# Altium project Service_board.PrjPcb (part 4 of 9)
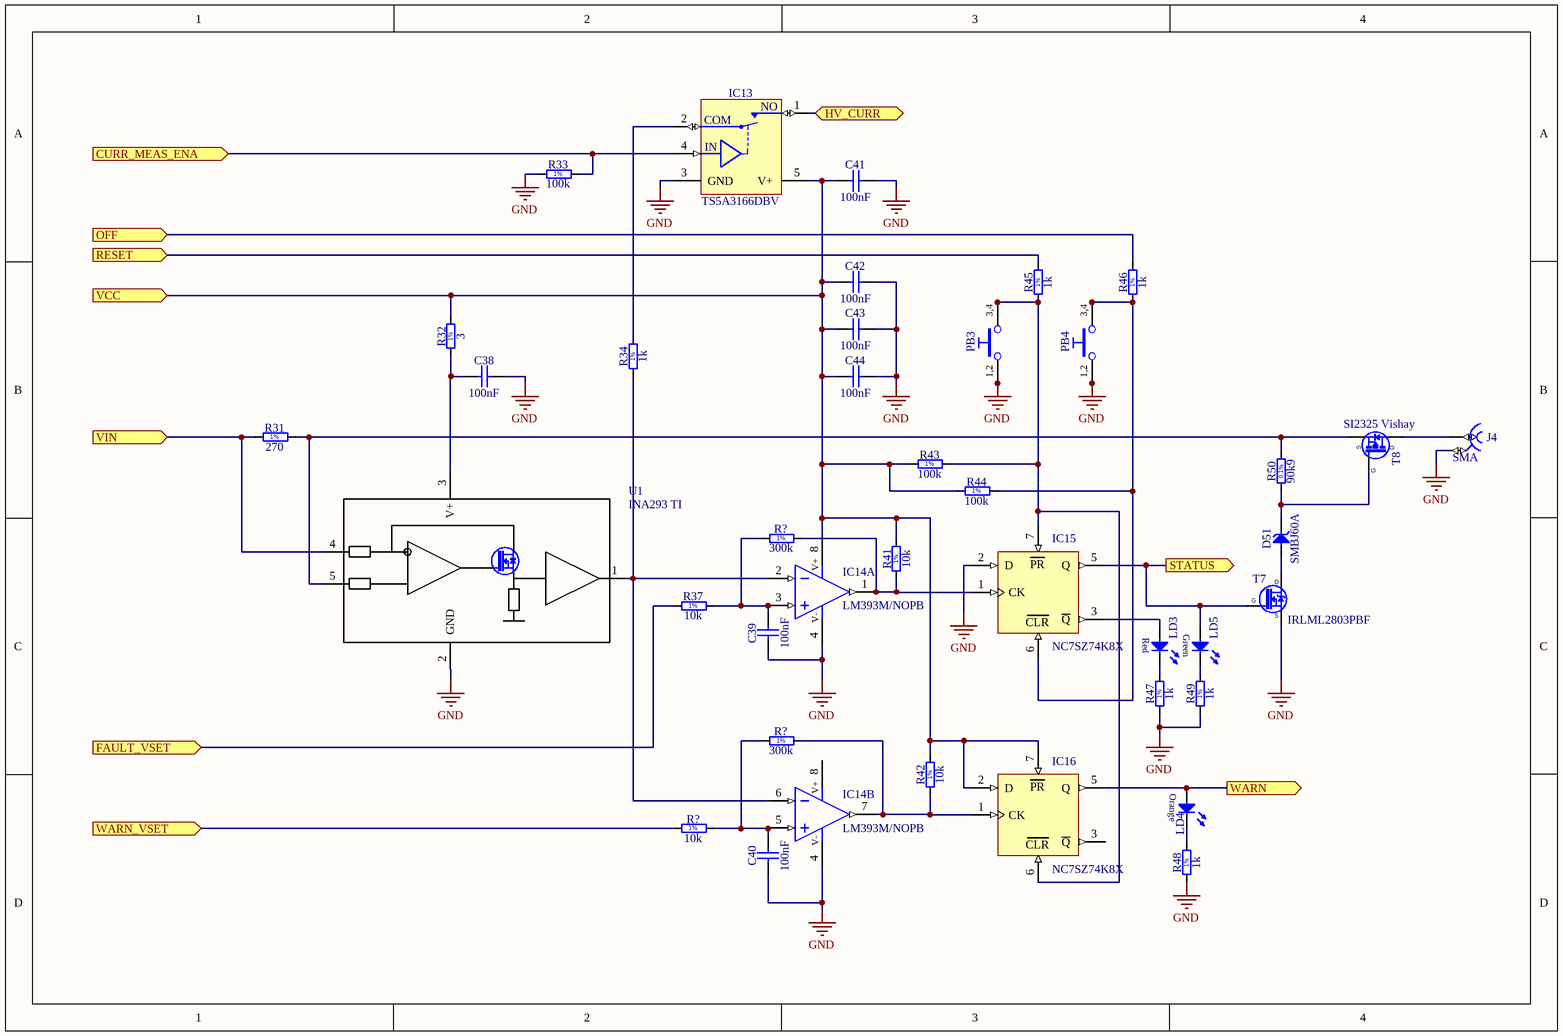
[diagram p10: Switch.SchDoc]

## Sheet Switch.SchDoc (continued)
### Channels
U_Bank/U_Channel/U_Switch: designators C38=C38_U_Bank_U_Channel_U_Switch#1 C39=C39_U_Bank_U_Channel_U_Switch#1 C40=C40_U_Bank_U_Channel_U_Switch#1 C41=C41_U_Bank_U_Channel_U_Switch#1 C42=C42_U_Bank_U_Channel_U_Switch#1 C43=C43_U_Bank_U_Channel_U_Switch#1 C44=C44_U_Bank_U_Channel_U_Switch#1 D51=D51_U_Bank_U_Channel_U_Switch#1 IC13=IC13_U_Bank_U_Channel_U_Switch#1 IC14=IC14_U_Bank_U_Channel_U_Switch#1 IC15=IC15_U_Bank_U_Channel_U_Switch#1 IC16=IC16_U_Bank_U_Channel_U_Switch#1 J4=J4_U_Bank_U_Channel_U_Switch#1 LD3=LD3_U_Bank_U_Channel_U_Switch#1 LD4=LD4_U_Bank_U_Channel_U_Switch#1 LD5=LD5_U_Bank_U_Channel_U_Switch#1 PB3=PB3_U_Bank_U_Channel_U_Switch#1 PB4=PB4_U_Bank_U_Channel_U_Switch#1 R31=R31_U_Bank_U_Channel_U_Switch#1 R32=R32_U_Bank_U_Channel_U_Switch#1 R33=R33_U_Bank_U_Channel_U_Switch#1 R34=R34_U_Bank_U_Channel_U_Switch#1 R37=R37_U_Bank_U_Channel_U_Switch#1 R41=R41_U_Bank_U_Channel_U_Switch#1 R42=R42_U_Bank_U_Channel_U_Switch#1 R43=R43_U_Bank_U_Channel_U_Switch#1 R44=R44_U_Bank_U_Channel_U_Switch#1 R45=R45_U_Bank_U_Channel_U_Switch#1 R46=R46_U_Bank_U_Channel_U_Switch#1 R47=R47_U_Bank_U_Channel_U_Switch#1 R48=R48_U_Bank_U_Channel_U_Switch#1 R49=R49_U_Bank_U_Channel_U_Switch#1 R50=R50_U_Bank_U_Channel_U_Switch#1 R?=R?_U_Bank_U_Channel_U_Switch#3 R?=R?_U_Bank_U_Channel_U_Switch#2 R?=R?_U_Bank_U_Channel_U_Switch#1 T7=T7_U_Bank_U_Channel_U_Switch#1 T8=T8_U_Bank_U_Channel_U_Switch#1 U1=U1_U_Bank_U_Channel_U_Switch#1; ports CURR_MEAS_ENA=NetIC2_U_Bank_U_Channel#1_14 FAULT_VSET=NetR37_U_Bank_U_Channel_U_Switch#1_1 HV_CURR=NetIC8_23 OFF=NetIC2_U_Bank_U_Channel#1_18 RESET=NetIC2_U_Bank_U_Channel#1_16 STATUS=NetIC2_U_Bank_U_Channel#1_8 VCC=NetC41_U_Bank_U_Channel_U_Switch#1_1 VIN=NetC?#3_2 WARN=W_A0 WARN_VSET=NetR?_U_Bank_U_Channel_U_Switch#3_1
U_Bank/U_Channel/U_Switch: designators C38=C38_U_Bank_U_Channel_U_Switch#2 C39=C39_U_Bank_U_Channel_U_Switch#2 C40=C40_U_Bank_U_Channel_U_Switch#2 C41=C41_U_Bank_U_Channel_U_Switch#2 C42=C42_U_Bank_U_Channel_U_Switch#2 C43=C43_U_Bank_U_Channel_U_Switch#2 C44=C44_U_Bank_U_Channel_U_Switch#2 D51=D51_U_Bank_U_Channel_U_Switch#2 IC13=IC13_U_Bank_U_Channel_U_Switch#2 IC14=IC14_U_Bank_U_Channel_U_Switch#2 IC15=IC15_U_Bank_U_Channel_U_Switch#2 IC16=IC16_U_Bank_U_Channel_U_Switch#2 J4=J4_U_Bank_U_Channel_U_Switch#2 LD3=LD3_U_Bank_U_Channel_U_Switch#2 LD4=LD4_U_Bank_U_Channel_U_Switch#2 LD5=LD5_U_Bank_U_Channel_U_Switch#2 PB3=PB3_U_Bank_U_Channel_U_Switch#2 PB4=PB4_U_Bank_U_Channel_U_Switch#2 R31=R31_U_Bank_U_Channel_U_Switch#2 R32=R32_U_Bank_U_Channel_U_Switch#2 R33=R33_U_Bank_U_Channel_U_Switch#2 R34=R34_U_Bank_U_Channel_U_Switch#2 R37=R37_U_Bank_U_Channel_U_Switch#2 R41=R41_U_Bank_U_Channel_U_Switch#2 R42=R42_U_Bank_U_Channel_U_Switch#2 R43=R43_U_Bank_U_Channel_U_Switch#2 R44=R44_U_Bank_U_Channel_U_Switch#2 R45=R45_U_Bank_U_Channel_U_Switch#2 R46=R46_U_Bank_U_Channel_U_Switch#2 R47=R47_U_Bank_U_Channel_U_Switch#2 R48=R48_U_Bank_U_Channel_U_Switch#2 R49=R49_U_Bank_U_Channel_U_Switch#2 R50=R50_U_Bank_U_Channel_U_Switch#2 R?=R?_U_Bank_U_Channel_U_Switch#6 R?=R?_U_Bank_U_Channel_U_Switch#5 R?=R?_U_Bank_U_Channel_U_Switch#4 T7=T7_U_Bank_U_Channel_U_Switch#2 T8=T8_U_Bank_U_Channel_U_Switch#2 U1=U1_U_Bank_U_Channel_U_Switch#2; ports CURR_MEAS_ENA=NetIC2_U_Bank_U_Channel#1_7 FAULT_VSET=NetR37_U_Bank_U_Channel_U_Switch#1_1 HV_CURR=NetIC8_23 OFF=NetIC2_U_Bank_U_Channel#1_3 RESET=NetIC2_U_Bank_U_Channel#1_5 STATUS=NetIC2_U_Bank_U_Channel#1_11 VCC=NetC41_U_Bank_U_Channel_U_Switch#1_1 VIN=NetC?#3_2 WARN=W_B0 WARN_VSET=NetR?_U_Bank_U_Channel_U_Switch#3_1
U_Bank/U_Channel/U_Switch: designators C38=C38_U_Bank_U_Channel_U_Switch#3 C39=C39_U_Bank_U_Channel_U_Switch#3 C40=C40_U_Bank_U_Channel_U_Switch#3 C41=C41_U_Bank_U_Channel_U_Switch#3 C42=C42_U_Bank_U_Channel_U_Switch#3 C43=C43_U_Bank_U_Channel_U_Switch#3 C44=C44_U_Bank_U_Channel_U_Switch#3 D51=D51_U_Bank_U_Channel_U_Switch#3 IC13=IC13_U_Bank_U_Channel_U_Switch#3 IC14=IC14_U_Bank_U_Channel_U_Switch#3 IC15=IC15_U_Bank_U_Channel_U_Switch#3 IC16=IC16_U_Bank_U_Channel_U_Switch#3 J4=J4_U_Bank_U_Channel_U_Switch#3 LD3=LD3_U_Bank_U_Channel_U_Switch#3 LD4=LD4_U_Bank_U_Channel_U_Switch#3 LD5=LD5_U_Bank_U_Channel_U_Switch#3 PB3=PB3_U_Bank_U_Channel_U_Switch#3 PB4=PB4_U_Bank_U_Channel_U_Switch#3 R31=R31_U_Bank_U_Channel_U_Switch#3 R32=R32_U_Bank_U_Channel_U_Switch#3 R33=R33_U_Bank_U_Channel_U_Switch#3 R34=R34_U_Bank_U_Channel_U_Switch#3 R37=R37_U_Bank_U_Channel_U_Switch#3 R41=R41_U_Bank_U_Channel_U_Switch#3 R42=R42_U_Bank_U_Channel_U_Switch#3 R43=R43_U_Bank_U_Channel_U_Switch#3 R44=R44_U_Bank_U_Channel_U_Switch#3 R45=R45_U_Bank_U_Channel_U_Switch#3 R46=R46_U_Bank_U_Channel_U_Switch#3 R47=R47_U_Bank_U_Channel_U_Switch#3 R48=R48_U_Bank_U_Channel_U_Switch#3 R49=R49_U_Bank_U_Channel_U_Switch#3 R50=R50_U_Bank_U_Channel_U_Switch#3 R?=R?_U_Bank_U_Channel_U_Switch#9 R?=R?_U_Bank_U_Channel_U_Switch#8 R?=R?_U_Bank_U_Channel_U_Switch#7 T7=T7_U_Bank_U_Channel_U_Switch#3 T8=T8_U_Bank_U_Channel_U_Switch#3 U1=U1_U_Bank_U_Channel_U_Switch#3; ports CURR_MEAS_ENA=NetIC2_U_Bank_U_Channel#2_14 FAULT_VSET=NetR37_U_Bank_U_Channel_U_Switch#1_1 HV_CURR=NetIC8_23 OFF=NetIC2_U_Bank_U_Channel#2_18 RESET=NetIC2_U_Bank_U_Channel#2_16 STATUS=NetIC2_U_Bank_U_Channel#2_8 VCC=NetC41_U_Bank_U_Channel_U_Switch#1_1 VIN=NetC?#3_2 WARN=W_A1 WARN_VSET=NetR?_U_Bank_U_Channel_U_Switch#3_1
U_Bank/U_Channel/U_Switch: designators C38=C38_U_Bank_U_Channel_U_Switch#4 C39=C39_U_Bank_U_Channel_U_Switch#4 C40=C40_U_Bank_U_Channel_U_Switch#4 C41=C41_U_Bank_U_Channel_U_Switch#4 C42=C42_U_Bank_U_Channel_U_Switch#4 C43=C43_U_Bank_U_Channel_U_Switch#4 C44=C44_U_Bank_U_Channel_U_Switch#4 D51=D51_U_Bank_U_Channel_U_Switch#4 IC13=IC13_U_Bank_U_Channel_U_Switch#4 IC14=IC14_U_Bank_U_Channel_U_Switch#4 IC15=IC15_U_Bank_U_Channel_U_Switch#4 IC16=IC16_U_Bank_U_Channel_U_Switch#4 J4=J4_U_Bank_U_Channel_U_Switch#4 LD3=LD3_U_Bank_U_Channel_U_Switch#4 LD4=LD4_U_Bank_U_Channel_U_Switch#4 LD5=LD5_U_Bank_U_Channel_U_Switch#4 PB3=PB3_U_Bank_U_Channel_U_Switch#4 PB4=PB4_U_Bank_U_Channel_U_Switch#4 R31=R31_U_Bank_U_Channel_U_Switch#4 R32=R32_U_Bank_U_Channel_U_Switch#4 R33=R33_U_Bank_U_Channel_U_Switch#4 R34=R34_U_Bank_U_Channel_U_Switch#4 R37=R37_U_Bank_U_Channel_U_Switch#4 R41=R41_U_Bank_U_Channel_U_Switch#4 R42=R42_U_Bank_U_Channel_U_Switch#4 R43=R43_U_Bank_U_Channel_U_Switch#4 R44=R44_U_Bank_U_Channel_U_Switch#4 R45=R45_U_Bank_U_Channel_U_Switch#4 R46=R46_U_Bank_U_Channel_U_Switch#4 R47=R47_U_Bank_U_Channel_U_Switch#4 R48=R48_U_Bank_U_Channel_U_Switch#4 R49=R49_U_Bank_U_Channel_U_Switch#4 R50=R50_U_Bank_U_Channel_U_Switch#4 R?=R?_U_Bank_U_Channel_U_Switch#12 R?=R?_U_Bank_U_Channel_U_Switch#11 R?=R?_U_Bank_U_Channel_U_Switch#10 T7=T7_U_Bank_U_Channel_U_Switch#4 T8=T8_U_Bank_U_Channel_U_Switch#4 U1=U1_U_Bank_U_Channel_U_Switch#4; ports CURR_MEAS_ENA=NetIC2_U_Bank_U_Channel#2_7 FAULT_VSET=NetR37_U_Bank_U_Channel_U_Switch#1_1 HV_CURR=NetIC8_23 OFF=NetIC2_U_Bank_U_Channel#2_3 RESET=NetIC2_U_Bank_U_Channel#2_5 STATUS=NetIC2_U_Bank_U_Channel#2_11 VCC=NetC41_U_Bank_U_Channel_U_Switch#1_1 VIN=NetC?#3_2 WARN=W_B1 WARN_VSET=NetR?_U_Bank_U_Channel_U_Switch#3_1
U_Bank/U_Channel/U_Switch: designators C38=C38_U_Bank_U_Channel_U_Switch#5 C39=C39_U_Bank_U_Channel_U_Switch#5 C40=C40_U_Bank_U_Channel_U_Switch#5 C41=C41_U_Bank_U_Channel_U_Switch#5 C42=C42_U_Bank_U_Channel_U_Switch#5 C43=C43_U_Bank_U_Channel_U_Switch#5 C44=C44_U_Bank_U_Channel_U_Switch#5 D51=D51_U_Bank_U_Channel_U_Switch#5 IC13=IC13_U_Bank_U_Channel_U_Switch#5 IC14=IC14_U_Bank_U_Channel_U_Switch#5 IC15=IC15_U_Bank_U_Channel_U_Switch#5 IC16=IC16_U_Bank_U_Channel_U_Switch#5 J4=J4_U_Bank_U_Channel_U_Switch#5 LD3=LD3_U_Bank_U_Channel_U_Switch#5 LD4=LD4_U_Bank_U_Channel_U_Switch#5 LD5=LD5_U_Bank_U_Channel_U_Switch#5 PB3=PB3_U_Bank_U_Channel_U_Switch#5 PB4=PB4_U_Bank_U_Channel_U_Switch#5 R31=R31_U_Bank_U_Channel_U_Switch#5 R32=R32_U_Bank_U_Channel_U_Switch#5 R33=R33_U_Bank_U_Channel_U_Switch#5 R34=R34_U_Bank_U_Channel_U_Switch#5 R37=R37_U_Bank_U_Channel_U_Switch#5 R41=R41_U_Bank_U_Channel_U_Switch#5 R42=R42_U_Bank_U_Channel_U_Switch#5 R43=R43_U_Bank_U_Channel_U_Switch#5 R44=R44_U_Bank_U_Channel_U_Switch#5 R45=R45_U_Bank_U_Channel_U_Switch#5 R46=R46_U_Bank_U_Channel_U_Switch#5 R47=R47_U_Bank_U_Channel_U_Switch#5 R48=R48_U_Bank_U_Channel_U_Switch#5 R49=R49_U_Bank_U_Channel_U_Switch#5 R50=R50_U_Bank_U_Channel_U_Switch#5 R?=R?_U_Bank_U_Channel_U_Switch#15 R?=R?_U_Bank_U_Channel_U_Switch#14 R?=R?_U_Bank_U_Channel_U_Switch#13 T7=T7_U_Bank_U_Channel_U_Switch#5 T8=T8_U_Bank_U_Channel_U_Switch#5 U1=U1_U_Bank_U_Channel_U_Switch#5; ports CURR_MEAS_ENA=NetIC2_U_Bank_U_Channel#3_14 FAULT_VSET=NetR37_U_Bank_U_Channel_U_Switch#1_1 HV_CURR=NetIC8_23 OFF=NetIC2_U_Bank_U_Channel#3_18 RESET=NetIC2_U_Bank_U_Channel#3_16 STATUS=NetIC2_U_Bank_U_Channel#3_8 VCC=NetC41_U_Bank_U_Channel_U_Switch#1_1 VIN=NetC?#3_2 WARN=W_A2 WARN_VSET=NetR?_U_Bank_U_Channel_U_Switch#3_1
U_Bank/U_Channel/U_Switch: designators C38=C38_U_Bank_U_Channel_U_Switch#6 C39=C39_U_Bank_U_Channel_U_Switch#6 C40=C40_U_Bank_U_Channel_U_Switch#6 C41=C41_U_Bank_U_Channel_U_Switch#6 C42=C42_U_Bank_U_Channel_U_Switch#6 C43=C43_U_Bank_U_Channel_U_Switch#6 C44=C44_U_Bank_U_Channel_U_Switch#6 D51=D51_U_Bank_U_Channel_U_Switch#6 IC13=IC13_U_Bank_U_Channel_U_Switch#6 IC14=IC14_U_Bank_U_Channel_U_Switch#6 IC15=IC15_U_Bank_U_Channel_U_Switch#6 IC16=IC16_U_Bank_U_Channel_U_Switch#6 J4=J4_U_Bank_U_Channel_U_Switch#6 LD3=LD3_U_Bank_U_Channel_U_Switch#6 LD4=LD4_U_Bank_U_Channel_U_Switch#6 LD5=LD5_U_Bank_U_Channel_U_Switch#6 PB3=PB3_U_Bank_U_Channel_U_Switch#6 PB4=PB4_U_Bank_U_Channel_U_Switch#6 R31=R31_U_Bank_U_Channel_U_Switch#6 R32=R32_U_Bank_U_Channel_U_Switch#6 R33=R33_U_Bank_U_Channel_U_Switch#6 R34=R34_U_Bank_U_Channel_U_Switch#6 R37=R37_U_Bank_U_Channel_U_Switch#6 R41=R41_U_Bank_U_Channel_U_Switch#6 R42=R42_U_Bank_U_Channel_U_Switch#6 R43=R43_U_Bank_U_Channel_U_Switch#6 R44=R44_U_Bank_U_Channel_U_Switch#6 R45=R45_U_Bank_U_Channel_U_Switch#6 R46=R46_U_Bank_U_Channel_U_Switch#6 R47=R47_U_Bank_U_Channel_U_Switch#6 R48=R48_U_Bank_U_Channel_U_Switch#6 R49=R49_U_Bank_U_Channel_U_Switch#6 R50=R50_U_Bank_U_Channel_U_Switch#6 R?=R?_U_Bank_U_Channel_U_Switch#18 R?=R?_U_Bank_U_Channel_U_Switch#17 R?=R?_U_Bank_U_Channel_U_Switch#16 T7=T7_U_Bank_U_Channel_U_Switch#6 T8=T8_U_Bank_U_Channel_U_Switch#6 U1=U1_U_Bank_U_Channel_U_Switch#6; ports CURR_MEAS_ENA=NetIC2_U_Bank_U_Channel#3_7 FAULT_VSET=NetR37_U_Bank_U_Channel_U_Switch#1_1 HV_CURR=NetIC8_23 OFF=NetIC2_U_Bank_U_Channel#3_3 RESET=NetIC2_U_Bank_U_Channel#3_5 STATUS=NetIC2_U_Bank_U_Channel#3_11 VCC=NetC41_U_Bank_U_Channel_U_Switch#1_1 VIN=NetC?#3_2 WARN=W_B2 WARN_VSET=NetR?_U_Bank_U_Channel_U_Switch#3_1
U_Bank/U_Channel/U_Switch: designators C38=C38_U_Bank_U_Channel_U_Switch#7 C39=C39_U_Bank_U_Channel_U_Switch#7 C40=C40_U_Bank_U_Channel_U_Switch#7 C41=C41_U_Bank_U_Channel_U_Switch#7 C42=C42_U_Bank_U_Channel_U_Switch#7 C43=C43_U_Bank_U_Channel_U_Switch#7 C44=C44_U_Bank_U_Channel_U_Switch#7 D51=D51_U_Bank_U_Channel_U_Switch#7 IC13=IC13_U_Bank_U_Channel_U_Switch#7 IC14=IC14_U_Bank_U_Channel_U_Switch#7 IC15=IC15_U_Bank_U_Channel_U_Switch#7 IC16=IC16_U_Bank_U_Channel_U_Switch#7 J4=J4_U_Bank_U_Channel_U_Switch#7 LD3=LD3_U_Bank_U_Channel_U_Switch#7 LD4=LD4_U_Bank_U_Channel_U_Switch#7 LD5=LD5_U_Bank_U_Channel_U_Switch#7 PB3=PB3_U_Bank_U_Channel_U_Switch#7 PB4=PB4_U_Bank_U_Channel_U_Switch#7 R31=R31_U_Bank_U_Channel_U_Switch#7 R32=R32_U_Bank_U_Channel_U_Switch#7 R33=R33_U_Bank_U_Channel_U_Switch#7 R34=R34_U_Bank_U_Channel_U_Switch#7 R37=R37_U_Bank_U_Channel_U_Switch#7 R41=R41_U_Bank_U_Channel_U_Switch#7 R42=R42_U_Bank_U_Channel_U_Switch#7 R43=R43_U_Bank_U_Channel_U_Switch#7 R44=R44_U_Bank_U_Channel_U_Switch#7 R45=R45_U_Bank_U_Channel_U_Switch#7 R46=R46_U_Bank_U_Channel_U_Switch#7 R47=R47_U_Bank_U_Channel_U_Switch#7 R48=R48_U_Bank_U_Channel_U_Switch#7 R49=R49_U_Bank_U_Channel_U_Switch#7 R50=R50_U_Bank_U_Channel_U_Switch#7 R?=R?_U_Bank_U_Channel_U_Switch#21 R?=R?_U_Bank_U_Channel_U_Switch#20 R?=R?_U_Bank_U_Channel_U_Switch#19 T7=T7_U_Bank_U_Channel_U_Switch#7 T8=T8_U_Bank_U_Channel_U_Switch#7 U1=U1_U_Bank_U_Channel_U_Switch#7; ports CURR_MEAS_ENA=NetIC2_U_Bank_U_Channel#4_14 FAULT_VSET=NetR37_U_Bank_U_Channel_U_Switch#1_1 HV_CURR=NetIC8_23 OFF=NetIC2_U_Bank_U_Channel#4_18 RESET=NetIC2_U_Bank_U_Channel#4_16 STATUS=NetIC2_U_Bank_U_Channel#4_8 VCC=NetC41_U_Bank_U_Channel_U_Switch#1_1 VIN=NetC?#3_2 WARN=W_A3 WARN_VSET=NetR?_U_Bank_U_Channel_U_Switch#3_1
U_Bank/U_Channel/U_Switch: designators C38=C38_U_Bank_U_Channel_U_Switch#8 C39=C39_U_Bank_U_Channel_U_Switch#8 C40=C40_U_Bank_U_Channel_U_Switch#8 C41=C41_U_Bank_U_Channel_U_Switch#8 C42=C42_U_Bank_U_Channel_U_Switch#8 C43=C43_U_Bank_U_Channel_U_Switch#8 C44=C44_U_Bank_U_Channel_U_Switch#8 D51=D51_U_Bank_U_Channel_U_Switch#8 IC13=IC13_U_Bank_U_Channel_U_Switch#8 IC14=IC14_U_Bank_U_Channel_U_Switch#8 IC15=IC15_U_Bank_U_Channel_U_Switch#8 IC16=IC16_U_Bank_U_Channel_U_Switch#8 J4=J4_U_Bank_U_Channel_U_Switch#8 LD3=LD3_U_Bank_U_Channel_U_Switch#8 LD4=LD4_U_Bank_U_Channel_U_Switch#8 LD5=LD5_U_Bank_U_Channel_U_Switch#8 PB3=PB3_U_Bank_U_Channel_U_Switch#8 PB4=PB4_U_Bank_U_Channel_U_Switch#8 R31=R31_U_Bank_U_Channel_U_Switch#8 R32=R32_U_Bank_U_Channel_U_Switch#8 R33=R33_U_Bank_U_Channel_U_Switch#8 R34=R34_U_Bank_U_Channel_U_Switch#8 R37=R37_U_Bank_U_Channel_U_Switch#8 R41=R41_U_Bank_U_Channel_U_Switch#8 R42=R42_U_Bank_U_Channel_U_Switch#8 R43=R43_U_Bank_U_Channel_U_Switch#8 R44=R44_U_Bank_U_Channel_U_Switch#8 R45=R45_U_Bank_U_Channel_U_Switch#8 R46=R46_U_Bank_U_Channel_U_Switch#8 R47=R47_U_Bank_U_Channel_U_Switch#8 R48=R48_U_Bank_U_Channel_U_Switch#8 R49=R49_U_Bank_U_Channel_U_Switch#8 R50=R50_U_Bank_U_Channel_U_Switch#8 R?=R?_U_Bank_U_Channel_U_Switch#24 R?=R?_U_Bank_U_Channel_U_Switch#23 R?=R?_U_Bank_U_Channel_U_Switch#22 T7=T7_U_Bank_U_Channel_U_Switch#8 T8=T8_U_Bank_U_Channel_U_Switch#8 U1=U1_U_Bank_U_Channel_U_Switch#8; ports CURR_MEAS_ENA=NetIC2_U_Bank_U_Channel#4_7 FAULT_VSET=NetR37_U_Bank_U_Channel_U_Switch#1_1 HV_CURR=NetIC8_23 OFF=NetIC2_U_Bank_U_Channel#4_3 RESET=NetIC2_U_Bank_U_Channel#4_5 STATUS=NetIC2_U_Bank_U_Channel#4_11 VCC=NetC41_U_Bank_U_Channel_U_Switch#1_1 VIN=NetC?#3_2 WARN=W_B3 WARN_VSET=NetR?_U_Bank_U_Channel_U_Switch#3_1
U_Bank/U_Channel/U_Switch: designators C38=C38_U_Bank_U_Channel_U_Switch#9 C39=C39_U_Bank_U_Channel_U_Switch#9 C40=C40_U_Bank_U_Channel_U_Switch#9 C41=C41_U_Bank_U_Channel_U_Switch#9 C42=C42_U_Bank_U_Channel_U_Switch#9 C43=C43_U_Bank_U_Channel_U_Switch#9 C44=C44_U_Bank_U_Channel_U_Switch#9 D51=D51_U_Bank_U_Channel_U_Switch#9 IC13=IC13_U_Bank_U_Channel_U_Switch#9 IC14=IC14_U_Bank_U_Channel_U_Switch#9 IC15=IC15_U_Bank_U_Channel_U_Switch#9 IC16=IC16_U_Bank_U_Channel_U_Switch#9 J4=J4_U_Bank_U_Channel_U_Switch#9 LD3=LD3_U_Bank_U_Channel_U_Switch#9 LD4=LD4_U_Bank_U_Channel_U_Switch#9 LD5=LD5_U_Bank_U_Channel_U_Switch#9 PB3=PB3_U_Bank_U_Channel_U_Switch#9 PB4=PB4_U_Bank_U_Channel_U_Switch#9 R31=R31_U_Bank_U_Channel_U_Switch#9 R32=R32_U_Bank_U_Channel_U_Switch#9 R33=R33_U_Bank_U_Channel_U_Switch#9 R34=R34_U_Bank_U_Channel_U_Switch#9 R37=R37_U_Bank_U_Channel_U_Switch#9 R41=R41_U_Bank_U_Channel_U_Switch#9 R42=R42_U_Bank_U_Channel_U_Switch#9 R43=R43_U_Bank_U_Channel_U_Switch#9 R44=R44_U_Bank_U_Channel_U_Switch#9 R45=R45_U_Bank_U_Channel_U_Switch#9 R46=R46_U_Bank_U_Channel_U_Switch#9 R47=R47_U_Bank_U_Channel_U_Switch#9 R48=R48_U_Bank_U_Channel_U_Switch#9 R49=R49_U_Bank_U_Channel_U_Switch#9 R50=R50_U_Bank_U_Channel_U_Switch#9 R?=R?_U_Bank_U_Channel_U_Switch#27 R?=R?_U_Bank_U_Channel_U_Switch#26 R?=R?_U_Bank_U_Channel_U_Switch#25 T7=T7_U_Bank_U_Channel_U_Switch#9 T8=T8_U_Bank_U_Channel_U_Switch#9 U1=U1_U_Bank_U_Channel_U_Switch#9; ports CURR_MEAS_ENA=NetIC2_U_Bank_U_Channel#5_14 FAULT_VSET=NetR37_U_Bank_U_Channel_U_Switch#1_1 HV_CURR=NetIC8_23 OFF=NetIC2_U_Bank_U_Channel#5_18 RESET=NetIC2_U_Bank_U_Channel#5_16 STATUS=NetIC2_U_Bank_U_Channel#5_8 VCC=NetC41_U_Bank_U_Channel_U_Switch#1_1 VIN=NetC?#3_2 WARN=W_A0 WARN_VSET=NetR?_U_Bank_U_Channel_U_Switch#3_1
U_Bank/U_Channel/U_Switch: designators C38=C38_U_Bank_U_Channel_U_Switch#10 C39=C39_U_Bank_U_Channel_U_Switch#10 C40=C40_U_Bank_U_Channel_U_Switch#10 C41=C41_U_Bank_U_Channel_U_Switch#10 C42=C42_U_Bank_U_Channel_U_Switch#10 C43=C43_U_Bank_U_Channel_U_Switch#10 C44=C44_U_Bank_U_Channel_U_Switch#10 D51=D51_U_Bank_U_Channel_U_Switch#10 IC13=IC13_U_Bank_U_Channel_U_Switch#10 IC14=IC14_U_Bank_U_Channel_U_Switch#10 IC15=IC15_U_Bank_U_Channel_U_Switch#10 IC16=IC16_U_Bank_U_Channel_U_Switch#10 J4=J4_U_Bank_U_Channel_U_Switch#10 LD3=LD3_U_Bank_U_Channel_U_Switch#10 LD4=LD4_U_Bank_U_Channel_U_Switch#10 LD5=LD5_U_Bank_U_Channel_U_Switch#10 PB3=PB3_U_Bank_U_Channel_U_Switch#10 PB4=PB4_U_Bank_U_Channel_U_Switch#10 R31=R31_U_Bank_U_Channel_U_Switch#10 R32=R32_U_Bank_U_Channel_U_Switch#10 R33=R33_U_Bank_U_Channel_U_Switch#10 R34=R34_U_Bank_U_Channel_U_Switch#10 R37=R37_U_Bank_U_Channel_U_Switch#10 R41=R41_U_Bank_U_Channel_U_Switch#10 R42=R42_U_Bank_U_Channel_U_Switch#10 R43=R43_U_Bank_U_Channel_U_Switch#10 R44=R44_U_Bank_U_Channel_U_Switch#10 R45=R45_U_Bank_U_Channel_U_Switch#10 R46=R46_U_Bank_U_Channel_U_Switch#10 R47=R47_U_Bank_U_Channel_U_Switch#10 R48=R48_U_Bank_U_Channel_U_Switch#10 R49=R49_U_Bank_U_Channel_U_Switch#10 R50=R50_U_Bank_U_Channel_U_Switch#10 R?=R?_U_Bank_U_Channel_U_Switch#30 R?=R?_U_Bank_U_Channel_U_Switch#29 R?=R?_U_Bank_U_Channel_U_Switch#28 T7=T7_U_Bank_U_Channel_U_Switch#10 T8=T8_U_Bank_U_Channel_U_Switch#10 U1=U1_U_Bank_U_Channel_U_Switch#10; ports CURR_MEAS_ENA=NetIC2_U_Bank_U_Channel#5_7 FAULT_VSET=NetR37_U_Bank_U_Channel_U_Switch#1_1 HV_CURR=NetIC8_23 OFF=NetIC2_U_Bank_U_Channel#5_3 RESET=NetIC2_U_Bank_U_Channel#5_5 STATUS=NetIC2_U_Bank_U_Channel#5_11 VCC=NetC41_U_Bank_U_Channel_U_Switch#1_1 VIN=NetC?#3_2 WARN=W_B0 WARN_VSET=NetR?_U_Bank_U_Channel_U_Switch#3_1
U_Bank/U_Channel/U_Switch: designators C38=C38_U_Bank_U_Channel_U_Switch#11 C39=C39_U_Bank_U_Channel_U_Switch#11 C40=C40_U_Bank_U_Channel_U_Switch#11 C41=C41_U_Bank_U_Channel_U_Switch#11 C42=C42_U_Bank_U_Channel_U_Switch#11 C43=C43_U_Bank_U_Channel_U_Switch#11 C44=C44_U_Bank_U_Channel_U_Switch#11 D51=D51_U_Bank_U_Channel_U_Switch#11 IC13=IC13_U_Bank_U_Channel_U_Switch#11 IC14=IC14_U_Bank_U_Channel_U_Switch#11 IC15=IC15_U_Bank_U_Channel_U_Switch#11 IC16=IC16_U_Bank_U_Channel_U_Switch#11 J4=J4_U_Bank_U_Channel_U_Switch#11 LD3=LD3_U_Bank_U_Channel_U_Switch#11 LD4=LD4_U_Bank_U_Channel_U_Switch#11 LD5=LD5_U_Bank_U_Channel_U_Switch#11 PB3=PB3_U_Bank_U_Channel_U_Switch#11 PB4=PB4_U_Bank_U_Channel_U_Switch#11 R31=R31_U_Bank_U_Channel_U_Switch#11 R32=R32_U_Bank_U_Channel_U_Switch#11 R33=R33_U_Bank_U_Channel_U_Switch#11 R34=R34_U_Bank_U_Channel_U_Switch#11 R37=R37_U_Bank_U_Channel_U_Switch#11 R41=R41_U_Bank_U_Channel_U_Switch#11 R42=R42_U_Bank_U_Channel_U_Switch#11 R43=R43_U_Bank_U_Channel_U_Switch#11 R44=R44_U_Bank_U_Channel_U_Switch#11 R45=R45_U_Bank_U_Channel_U_Switch#11 R46=R46_U_Bank_U_Channel_U_Switch#11 R47=R47_U_Bank_U_Channel_U_Switch#11 R48=R48_U_Bank_U_Channel_U_Switch#11 R49=R49_U_Bank_U_Channel_U_Switch#11 R50=R50_U_Bank_U_Channel_U_Switch#11 R?=R?_U_Bank_U_Channel_U_Switch#33 R?=R?_U_Bank_U_Channel_U_Switch#32 R?=R?_U_Bank_U_Channel_U_Switch#31 T7=T7_U_Bank_U_Channel_U_Switch#11 T8=T8_U_Bank_U_Channel_U_Switch#11 U1=U1_U_Bank_U_Channel_U_Switch#11; ports CURR_MEAS_ENA=NetIC2_U_Bank_U_Channel#6_14 FAULT_VSET=NetR37_U_Bank_U_Channel_U_Switch#1_1 HV_CURR=NetIC8_23 OFF=NetIC2_U_Bank_U_Channel#6_18 RESET=NetIC2_U_Bank_U_Channel#6_16 STATUS=NetIC2_U_Bank_U_Channel#6_8 VCC=NetC41_U_Bank_U_Channel_U_Switch#1_1 VIN=NetC?#3_2 WARN=W_A1 WARN_VSET=NetR?_U_Bank_U_Channel_U_Switch#3_1
U_Bank/U_Channel/U_Switch: designators C38=C38_U_Bank_U_Channel_U_Switch#12 C39=C39_U_Bank_U_Channel_U_Switch#12 C40=C40_U_Bank_U_Channel_U_Switch#12 C41=C41_U_Bank_U_Channel_U_Switch#12 C42=C42_U_Bank_U_Channel_U_Switch#12 C43=C43_U_Bank_U_Channel_U_Switch#12 C44=C44_U_Bank_U_Channel_U_Switch#12 D51=D51_U_Bank_U_Channel_U_Switch#12 IC13=IC13_U_Bank_U_Channel_U_Switch#12 IC14=IC14_U_Bank_U_Channel_U_Switch#12 IC15=IC15_U_Bank_U_Channel_U_Switch#12 IC16=IC16_U_Bank_U_Channel_U_Switch#12 J4=J4_U_Bank_U_Channel_U_Switch#12 LD3=LD3_U_Bank_U_Channel_U_Switch#12 LD4=LD4_U_Bank_U_Channel_U_Switch#12 LD5=LD5_U_Bank_U_Channel_U_Switch#12 PB3=PB3_U_Bank_U_Channel_U_Switch#12 PB4=PB4_U_Bank_U_Channel_U_Switch#12 R31=R31_U_Bank_U_Channel_U_Switch#12 R32=R32_U_Bank_U_Channel_U_Switch#12 R33=R33_U_Bank_U_Channel_U_Switch#12 R34=R34_U_Bank_U_Channel_U_Switch#12 R37=R37_U_Bank_U_Channel_U_Switch#12 R41=R41_U_Bank_U_Channel_U_Switch#12 R42=R42_U_Bank_U_Channel_U_Switch#12 R43=R43_U_Bank_U_Channel_U_Switch#12 R44=R44_U_Bank_U_Channel_U_Switch#12 R45=R45_U_Bank_U_Channel_U_Switch#12 R46=R46_U_Bank_U_Channel_U_Switch#12 R47=R47_U_Bank_U_Channel_U_Switch#12 R48=R48_U_Bank_U_Channel_U_Switch#12 R49=R49_U_Bank_U_Channel_U_Switch#12 R50=R50_U_Bank_U_Channel_U_Switch#12 R?=R?_U_Bank_U_Channel_U_Switch#36 R?=R?_U_Bank_U_Channel_U_Switch#35 R?=R?_U_Bank_U_Channel_U_Switch#34 T7=T7_U_Bank_U_Channel_U_Switch#12 T8=T8_U_Bank_U_Channel_U_Switch#12 U1=U1_U_Bank_U_Channel_U_Switch#12; ports CURR_MEAS_ENA=NetIC2_U_Bank_U_Channel#6_7 FAULT_VSET=NetR37_U_Bank_U_Channel_U_Switch#1_1 HV_CURR=NetIC8_23 OFF=NetIC2_U_Bank_U_Channel#6_3 RESET=NetIC2_U_Bank_U_Channel#6_5 STATUS=NetIC2_U_Bank_U_Channel#6_11 VCC=NetC41_U_Bank_U_Channel_U_Switch#1_1 VIN=NetC?#3_2 WARN=W_B1 WARN_VSET=NetR?_U_Bank_U_Channel_U_Switch#3_1
U_Bank/U_Channel/U_Switch: designators C38=C38_U_Bank_U_Channel_U_Switch#13 C39=C39_U_Bank_U_Channel_U_Switch#13 C40=C40_U_Bank_U_Channel_U_Switch#13 C41=C41_U_Bank_U_Channel_U_Switch#13 C42=C42_U_Bank_U_Channel_U_Switch#13 C43=C43_U_Bank_U_Channel_U_Switch#13 C44=C44_U_Bank_U_Channel_U_Switch#13 D51=D51_U_Bank_U_Channel_U_Switch#13 IC13=IC13_U_Bank_U_Channel_U_Switch#13 IC14=IC14_U_Bank_U_Channel_U_Switch#13 IC15=IC15_U_Bank_U_Channel_U_Switch#13 IC16=IC16_U_Bank_U_Channel_U_Switch#13 J4=J4_U_Bank_U_Channel_U_Switch#13 LD3=LD3_U_Bank_U_Channel_U_Switch#13 LD4=LD4_U_Bank_U_Channel_U_Switch#13 LD5=LD5_U_Bank_U_Channel_U_Switch#13 PB3=PB3_U_Bank_U_Channel_U_Switch#13 PB4=PB4_U_Bank_U_Channel_U_Switch#13 R31=R31_U_Bank_U_Channel_U_Switch#13 R32=R32_U_Bank_U_Channel_U_Switch#13 R33=R33_U_Bank_U_Channel_U_Switch#13 R34=R34_U_Bank_U_Channel_U_Switch#13 R37=R37_U_Bank_U_Channel_U_Switch#13 R41=R41_U_Bank_U_Channel_U_Switch#13 R42=R42_U_Bank_U_Channel_U_Switch#13 R43=R43_U_Bank_U_Channel_U_Switch#13 R44=R44_U_Bank_U_Channel_U_Switch#13 R45=R45_U_Bank_U_Channel_U_Switch#13 R46=R46_U_Bank_U_Channel_U_Switch#13 R47=R47_U_Bank_U_Channel_U_Switch#13 R48=R48_U_Bank_U_Channel_U_Switch#13 R49=R49_U_Bank_U_Channel_U_Switch#13 R50=R50_U_Bank_U_Channel_U_Switch#13 R?=R?_U_Bank_U_Channel_U_Switch#39 R?=R?_U_Bank_U_Channel_U_Switch#38 R?=R?_U_Bank_U_Channel_U_Switch#37 T7=T7_U_Bank_U_Channel_U_Switch#13 T8=T8_U_Bank_U_Channel_U_Switch#13 U1=U1_U_Bank_U_Channel_U_Switch#13; ports CURR_MEAS_ENA=NetIC2_U_Bank_U_Channel#7_14 FAULT_VSET=NetR37_U_Bank_U_Channel_U_Switch#1_1 HV_CURR=NetIC8_23 OFF=NetIC2_U_Bank_U_Channel#7_18 RESET=NetIC2_U_Bank_U_Channel#7_16 STATUS=NetIC2_U_Bank_U_Channel#7_8 VCC=NetC41_U_Bank_U_Channel_U_Switch#1_1 VIN=NetC?#3_2 WARN=W_A2 WARN_VSET=NetR?_U_Bank_U_Channel_U_Switch#3_1
U_Bank/U_Channel/U_Switch: designators C38=C38_U_Bank_U_Channel_U_Switch#14 C39=C39_U_Bank_U_Channel_U_Switch#14 C40=C40_U_Bank_U_Channel_U_Switch#14 C41=C41_U_Bank_U_Channel_U_Switch#14 C42=C42_U_Bank_U_Channel_U_Switch#14 C43=C43_U_Bank_U_Channel_U_Switch#14 C44=C44_U_Bank_U_Channel_U_Switch#14 D51=D51_U_Bank_U_Channel_U_Switch#14 IC13=IC13_U_Bank_U_Channel_U_Switch#14 IC14=IC14_U_Bank_U_Channel_U_Switch#14 IC15=IC15_U_Bank_U_Channel_U_Switch#14 IC16=IC16_U_Bank_U_Channel_U_Switch#14 J4=J4_U_Bank_U_Channel_U_Switch#14 LD3=LD3_U_Bank_U_Channel_U_Switch#14 LD4=LD4_U_Bank_U_Channel_U_Switch#14 LD5=LD5_U_Bank_U_Channel_U_Switch#14 PB3=PB3_U_Bank_U_Channel_U_Switch#14 PB4=PB4_U_Bank_U_Channel_U_Switch#14 R31=R31_U_Bank_U_Channel_U_Switch#14 R32=R32_U_Bank_U_Channel_U_Switch#14 R33=R33_U_Bank_U_Channel_U_Switch#14 R34=R34_U_Bank_U_Channel_U_Switch#14 R37=R37_U_Bank_U_Channel_U_Switch#14 R41=R41_U_Bank_U_Channel_U_Switch#14 R42=R42_U_Bank_U_Channel_U_Switch#14 R43=R43_U_Bank_U_Channel_U_Switch#14 R44=R44_U_Bank_U_Channel_U_Switch#14 R45=R45_U_Bank_U_Channel_U_Switch#14 R46=R46_U_Bank_U_Channel_U_Switch#14 R47=R47_U_Bank_U_Channel_U_Switch#14 R48=R48_U_Bank_U_Channel_U_Switch#14 R49=R49_U_Bank_U_Channel_U_Switch#14 R50=R50_U_Bank_U_Channel_U_Switch#14 R?=R?_U_Bank_U_Channel_U_Switch#42 R?=R?_U_Bank_U_Channel_U_Switch#41 R?=R?_U_Bank_U_Channel_U_Switch#40 T7=T7_U_Bank_U_Channel_U_Switch#14 T8=T8_U_Bank_U_Channel_U_Switch#14 U1=U1_U_Bank_U_Channel_U_Switch#14; ports CURR_MEAS_ENA=NetIC2_U_Bank_U_Channel#7_7 FAULT_VSET=NetR37_U_Bank_U_Channel_U_Switch#1_1 HV_CURR=NetIC8_23 OFF=NetIC2_U_Bank_U_Channel#7_3 RESET=NetIC2_U_Bank_U_Channel#7_5 STATUS=NetIC2_U_Bank_U_Channel#7_11 VCC=NetC41_U_Bank_U_Channel_U_Switch#1_1 VIN=NetC?#3_2 WARN=W_B2 WARN_VSET=NetR?_U_Bank_U_Channel_U_Switch#3_1
U_Bank/U_Channel/U_Switch: designators C38=C38_U_Bank_U_Channel_U_Switch#15 C39=C39_U_Bank_U_Channel_U_Switch#15 C40=C40_U_Bank_U_Channel_U_Switch#15 C41=C41_U_Bank_U_Channel_U_Switch#15 C42=C42_U_Bank_U_Channel_U_Switch#15 C43=C43_U_Bank_U_Channel_U_Switch#15 C44=C44_U_Bank_U_Channel_U_Switch#15 D51=D51_U_Bank_U_Channel_U_Switch#15 IC13=IC13_U_Bank_U_Channel_U_Switch#15 IC14=IC14_U_Bank_U_Channel_U_Switch#15 IC15=IC15_U_Bank_U_Channel_U_Switch#15 IC16=IC16_U_Bank_U_Channel_U_Switch#15 J4=J4_U_Bank_U_Channel_U_Switch#15 LD3=LD3_U_Bank_U_Channel_U_Switch#15 LD4=LD4_U_Bank_U_Channel_U_Switch#15 LD5=LD5_U_Bank_U_Channel_U_Switch#15 PB3=PB3_U_Bank_U_Channel_U_Switch#15 PB4=PB4_U_Bank_U_Channel_U_Switch#15 R31=R31_U_Bank_U_Channel_U_Switch#15 R32=R32_U_Bank_U_Channel_U_Switch#15 R33=R33_U_Bank_U_Channel_U_Switch#15 R34=R34_U_Bank_U_Channel_U_Switch#15 R37=R37_U_Bank_U_Channel_U_Switch#15 R41=R41_U_Bank_U_Channel_U_Switch#15 R42=R42_U_Bank_U_Channel_U_Switch#15 R43=R43_U_Bank_U_Channel_U_Switch#15 R44=R44_U_Bank_U_Channel_U_Switch#15 R45=R45_U_Bank_U_Channel_U_Switch#15 R46=R46_U_Bank_U_Channel_U_Switch#15 R47=R47_U_Bank_U_Channel_U_Switch#15 R48=R48_U_Bank_U_Channel_U_Switch#15 R49=R49_U_Bank_U_Channel_U_Switch#15 R50=R50_U_Bank_U_Channel_U_Switch#15 R?=R?_U_Bank_U_Channel_U_Switch#45 R?=R?_U_Bank_U_Channel_U_Switch#44 R?=R?_U_Bank_U_Channel_U_Switch#43 T7=T7_U_Bank_U_Channel_U_Switch#15 T8=T8_U_Bank_U_Channel_U_Switch#15 U1=U1_U_Bank_U_Channel_U_Switch#15; ports CURR_MEAS_ENA=NetIC2_U_Bank_U_Channel#8_14 FAULT_VSET=NetR37_U_Bank_U_Channel_U_Switch#1_1 HV_CURR=NetIC8_23 OFF=NetIC2_U_Bank_U_Channel#8_18 RESET=NetIC2_U_Bank_U_Channel#8_16 STATUS=NetIC2_U_Bank_U_Channel#8_8 VCC=NetC41_U_Bank_U_Channel_U_Switch#1_1 VIN=NetC?#3_2 WARN=W_A3 WARN_VSET=NetR?_U_Bank_U_Channel_U_Switch#3_1
U_Bank/U_Channel/U_Switch: designators C38=C38_U_Bank_U_Channel_U_Switch#16 C39=C39_U_Bank_U_Channel_U_Switch#16 C40=C40_U_Bank_U_Channel_U_Switch#16 C41=C41_U_Bank_U_Channel_U_Switch#16 C42=C42_U_Bank_U_Channel_U_Switch#16 C43=C43_U_Bank_U_Channel_U_Switch#16 C44=C44_U_Bank_U_Channel_U_Switch#16 D51=D51_U_Bank_U_Channel_U_Switch#16 IC13=IC13_U_Bank_U_Channel_U_Switch#16 IC14=IC14_U_Bank_U_Channel_U_Switch#16 IC15=IC15_U_Bank_U_Channel_U_Switch#16 IC16=IC16_U_Bank_U_Channel_U_Switch#16 J4=J4_U_Bank_U_Channel_U_Switch#16 LD3=LD3_U_Bank_U_Channel_U_Switch#16 LD4=LD4_U_Bank_U_Channel_U_Switch#16 LD5=LD5_U_Bank_U_Channel_U_Switch#16 PB3=PB3_U_Bank_U_Channel_U_Switch#16 PB4=PB4_U_Bank_U_Channel_U_Switch#16 R31=R31_U_Bank_U_Channel_U_Switch#16 R32=R32_U_Bank_U_Channel_U_Switch#16 R33=R33_U_Bank_U_Channel_U_Switch#16 R34=R34_U_Bank_U_Channel_U_Switch#16 R37=R37_U_Bank_U_Channel_U_Switch#16 R41=R41_U_Bank_U_Channel_U_Switch#16 R42=R42_U_Bank_U_Channel_U_Switch#16 R43=R43_U_Bank_U_Channel_U_Switch#16 R44=R44_U_Bank_U_Channel_U_Switch#16 R45=R45_U_Bank_U_Channel_U_Switch#16 R46=R46_U_Bank_U_Channel_U_Switch#16 R47=R47_U_Bank_U_Channel_U_Switch#16 R48=R48_U_Bank_U_Channel_U_Switch#16 R49=R49_U_Bank_U_Channel_U_Switch#16 R50=R50_U_Bank_U_Channel_U_Switch#16 R?=R?_U_Bank_U_Channel_U_Switch#48 R?=R?_U_Bank_U_Channel_U_Switch#47 R?=R?_U_Bank_U_Channel_U_Switch#46 T7=T7_U_Bank_U_Channel_U_Switch#16 T8=T8_U_Bank_U_Channel_U_Switch#16 U1=U1_U_Bank_U_Channel_U_Switch#16; ports CURR_MEAS_ENA=NetIC2_U_Bank_U_Channel#8_7 FAULT_VSET=NetR37_U_Bank_U_Channel_U_Switch#1_1 HV_CURR=NetIC8_23 OFF=NetIC2_U_Bank_U_Channel#8_3 RESET=NetIC2_U_Bank_U_Channel#8_5 STATUS=NetIC2_U_Bank_U_Channel#8_11 VCC=NetC41_U_Bank_U_Channel_U_Switch#1_1 VIN=NetC?#3_2 WARN=W_B3 WARN_VSET=NetR?_U_Bank_U_Channel_U_Switch#3_1
U_Bank/U_Channel/U_Switch: designators C38=C38_U_Bank_U_Channel_U_Switch#17 C39=C39_U_Bank_U_Channel_U_Switch#17 C40=C40_U_Bank_U_Channel_U_Switch#17 C41=C41_U_Bank_U_Channel_U_Switch#17 C42=C42_U_Bank_U_Channel_U_Switch#17 C43=C43_U_Bank_U_Channel_U_Switch#17 C44=C44_U_Bank_U_Channel_U_Switch#17 D51=D51_U_Bank_U_Channel_U_Switch#17 IC13=IC13_U_Bank_U_Channel_U_Switch#17 IC14=IC14_U_Bank_U_Channel_U_Switch#17 IC15=IC15_U_Bank_U_Channel_U_Switch#17 IC16=IC16_U_Bank_U_Channel_U_Switch#17 J4=J4_U_Bank_U_Channel_U_Switch#17 LD3=LD3_U_Bank_U_Channel_U_Switch#17 LD4=LD4_U_Bank_U_Channel_U_Switch#17 LD5=LD5_U_Bank_U_Channel_U_Switch#17 PB3=PB3_U_Bank_U_Channel_U_Switch#17 PB4=PB4_U_Bank_U_Channel_U_Switch#17 R31=R31_U_Bank_U_Channel_U_Switch#17 R32=R32_U_Bank_U_Channel_U_Switch#17 R33=R33_U_Bank_U_Channel_U_Switch#17 R34=R34_U_Bank_U_Channel_U_Switch#17 R37=R37_U_Bank_U_Channel_U_Switch#17 R41=R41_U_Bank_U_Channel_U_Switch#17 R42=R42_U_Bank_U_Channel_U_Switch#17 R43=R43_U_Bank_U_Channel_U_Switch#17 R44=R44_U_Bank_U_Channel_U_Switch#17 R45=R45_U_Bank_U_Channel_U_Switch#17 R46=R46_U_Bank_U_Channel_U_Switch#17 R47=R47_U_Bank_U_Channel_U_Switch#17 R48=R48_U_Bank_U_Channel_U_Switch#17 R49=R49_U_Bank_U_Channel_U_Switch#17 R50=R50_U_Bank_U_Channel_U_Switch#17 R?=R?_U_Bank_U_Channel_U_Switch#51 R?=R?_U_Bank_U_Channel_U_Switch#50 R?=R?_U_Bank_U_Channel_U_Switch#49 T7=T7_U_Bank_U_Channel_U_Switch#17 T8=T8_U_Bank_U_Channel_U_Switch#17 U1=U1_U_Bank_U_Channel_U_Switch#17; ports CURR_MEAS_ENA=NetIC2_U_Bank_U_Channel#9_14 FAULT_VSET=NetR37_U_Bank_U_Channel_U_Switch#1_1 HV_CURR=NetIC8_23 OFF=NetIC2_U_Bank_U_Channel#9_18 RESET=NetIC2_U_Bank_U_Channel#9_16 STATUS=NetIC2_U_Bank_U_Channel#9_8 VCC=NetC41_U_Bank_U_Channel_U_Switch#1_1 VIN=NetC?#3_2 WARN=W_A0 WARN_VSET=NetR?_U_Bank_U_Channel_U_Switch#3_1
U_Bank/U_Channel/U_Switch: designators C38=C38_U_Bank_U_Channel_U_Switch#18 C39=C39_U_Bank_U_Channel_U_Switch#18 C40=C40_U_Bank_U_Channel_U_Switch#18 C41=C41_U_Bank_U_Channel_U_Switch#18 C42=C42_U_Bank_U_Channel_U_Switch#18 C43=C43_U_Bank_U_Channel_U_Switch#18 C44=C44_U_Bank_U_Channel_U_Switch#18 D51=D51_U_Bank_U_Channel_U_Switch#18 IC13=IC13_U_Bank_U_Channel_U_Switch#18 IC14=IC14_U_Bank_U_Channel_U_Switch#18 IC15=IC15_U_Bank_U_Channel_U_Switch#18 IC16=IC16_U_Bank_U_Channel_U_Switch#18 J4=J4_U_Bank_U_Channel_U_Switch#18 LD3=LD3_U_Bank_U_Channel_U_Switch#18 LD4=LD4_U_Bank_U_Channel_U_Switch#18 LD5=LD5_U_Bank_U_Channel_U_Switch#18 PB3=PB3_U_Bank_U_Channel_U_Switch#18 PB4=PB4_U_Bank_U_Channel_U_Switch#18 R31=R31_U_Bank_U_Channel_U_Switch#18 R32=R32_U_Bank_U_Channel_U_Switch#18 R33=R33_U_Bank_U_Channel_U_Switch#18 R34=R34_U_Bank_U_Channel_U_Switch#18 R37=R37_U_Bank_U_Channel_U_Switch#18 R41=R41_U_Bank_U_Channel_U_Switch#18 R42=R42_U_Bank_U_Channel_U_Switch#18 R43=R43_U_Bank_U_Channel_U_Switch#18 R44=R44_U_Bank_U_Channel_U_Switch#18 R45=R45_U_Bank_U_Channel_U_Switch#18 R46=R46_U_Bank_U_Channel_U_Switch#18 R47=R47_U_Bank_U_Channel_U_Switch#18 R48=R48_U_Bank_U_Channel_U_Switch#18 R49=R49_U_Bank_U_Channel_U_Switch#18 R50=R50_U_Bank_U_Channel_U_Switch#18 R?=R?_U_Bank_U_Channel_U_Switch#54 R?=R?_U_Bank_U_Channel_U_Switch#53 R?=R?_U_Bank_U_Channel_U_Switch#52 T7=T7_U_Bank_U_Channel_U_Switch#18 T8=T8_U_Bank_U_Channel_U_Switch#18 U1=U1_U_Bank_U_Channel_U_Switch#18; ports CURR_MEAS_ENA=NetIC2_U_Bank_U_Channel#9_7 FAULT_VSET=NetR37_U_Bank_U_Channel_U_Switch#1_1 HV_CURR=NetIC8_23 OFF=NetIC2_U_Bank_U_Channel#9_3 RESET=NetIC2_U_Bank_U_Channel#9_5 STATUS=NetIC2_U_Bank_U_Channel#9_11 VCC=NetC41_U_Bank_U_Channel_U_Switch#1_1 VIN=NetC?#3_2 WARN=W_B0 WARN_VSET=NetR?_U_Bank_U_Channel_U_Switch#3_1
U_Bank/U_Channel/U_Switch: designators C38=C38_U_Bank_U_Channel_U_Switch#19 C39=C39_U_Bank_U_Channel_U_Switch#19 C40=C40_U_Bank_U_Channel_U_Switch#19 C41=C41_U_Bank_U_Channel_U_Switch#19 C42=C42_U_Bank_U_Channel_U_Switch#19 C43=C43_U_Bank_U_Channel_U_Switch#19 C44=C44_U_Bank_U_Channel_U_Switch#19 D51=D51_U_Bank_U_Channel_U_Switch#19 IC13=IC13_U_Bank_U_Channel_U_Switch#19 IC14=IC14_U_Bank_U_Channel_U_Switch#19 IC15=IC15_U_Bank_U_Channel_U_Switch#19 IC16=IC16_U_Bank_U_Channel_U_Switch#19 J4=J4_U_Bank_U_Channel_U_Switch#19 LD3=LD3_U_Bank_U_Channel_U_Switch#19 LD4=LD4_U_Bank_U_Channel_U_Switch#19 LD5=LD5_U_Bank_U_Channel_U_Switch#19 PB3=PB3_U_Bank_U_Channel_U_Switch#19 PB4=PB4_U_Bank_U_Channel_U_Switch#19 R31=R31_U_Bank_U_Channel_U_Switch#19 R32=R32_U_Bank_U_Channel_U_Switch#19 R33=R33_U_Bank_U_Channel_U_Switch#19 R34=R34_U_Bank_U_Channel_U_Switch#19 R37=R37_U_Bank_U_Channel_U_Switch#19 R41=R41_U_Bank_U_Channel_U_Switch#19 R42=R42_U_Bank_U_Channel_U_Switch#19 R43=R43_U_Bank_U_Channel_U_Switch#19 R44=R44_U_Bank_U_Channel_U_Switch#19 R45=R45_U_Bank_U_Channel_U_Switch#19 R46=R46_U_Bank_U_Channel_U_Switch#19 R47=R47_U_Bank_U_Channel_U_Switch#19 R48=R48_U_Bank_U_Channel_U_Switch#19 R49=R49_U_Bank_U_Channel_U_Switch#19 R50=R50_U_Bank_U_Channel_U_Switch#19 R?=R?_U_Bank_U_Channel_U_Switch#57 R?=R?_U_Bank_U_Channel_U_Switch#56 R?=R?_U_Bank_U_Channel_U_Switch#55 T7=T7_U_Bank_U_Channel_U_Switch#19 T8=T8_U_Bank_U_Channel_U_Switch#19 U1=U1_U_Bank_U_Channel_U_Switch#19; ports CURR_MEAS_ENA=NetIC2_U_Bank_U_Channel#10_14 FAULT_VSET=NetR37_U_Bank_U_Channel_U_Switch#1_1 HV_CURR=NetIC8_23 OFF=NetIC2_U_Bank_U_Channel#10_18 RESET=NetIC2_U_Bank_U_Channel#10_16 STATUS=NetIC2_U_Bank_U_Channel#10_8 VCC=NetC41_U_Bank_U_Channel_U_Switch#1_1 VIN=NetC?#3_2 WARN=W_A1 WARN_VSET=NetR?_U_Bank_U_Channel_U_Switch#3_1
U_Bank/U_Channel/U_Switch: designators C38=C38_U_Bank_U_Channel_U_Switch#20 C39=C39_U_Bank_U_Channel_U_Switch#20 C40=C40_U_Bank_U_Channel_U_Switch#20 C41=C41_U_Bank_U_Channel_U_Switch#20 C42=C42_U_Bank_U_Channel_U_Switch#20 C43=C43_U_Bank_U_Channel_U_Switch#20 C44=C44_U_Bank_U_Channel_U_Switch#20 D51=D51_U_Bank_U_Channel_U_Switch#20 IC13=IC13_U_Bank_U_Channel_U_Switch#20 IC14=IC14_U_Bank_U_Channel_U_Switch#20 IC15=IC15_U_Bank_U_Channel_U_Switch#20 IC16=IC16_U_Bank_U_Channel_U_Switch#20 J4=J4_U_Bank_U_Channel_U_Switch#20 LD3=LD3_U_Bank_U_Channel_U_Switch#20 LD4=LD4_U_Bank_U_Channel_U_Switch#20 LD5=LD5_U_Bank_U_Channel_U_Switch#20 PB3=PB3_U_Bank_U_Channel_U_Switch#20 PB4=PB4_U_Bank_U_Channel_U_Switch#20 R31=R31_U_Bank_U_Channel_U_Switch#20 R32=R32_U_Bank_U_Channel_U_Switch#20 R33=R33_U_Bank_U_Channel_U_Switch#20 R34=R34_U_Bank_U_Channel_U_Switch#20 R37=R37_U_Bank_U_Channel_U_Switch#20 R41=R41_U_Bank_U_Channel_U_Switch#20 R42=R42_U_Bank_U_Channel_U_Switch#20 R43=R43_U_Bank_U_Channel_U_Switch#20 R44=R44_U_Bank_U_Channel_U_Switch#20 R45=R45_U_Bank_U_Channel_U_Switch#20 R46=R46_U_Bank_U_Channel_U_Switch#20 R47=R47_U_Bank_U_Channel_U_Switch#20 R48=R48_U_Bank_U_Channel_U_Switch#20 R49=R49_U_Bank_U_Channel_U_Switch#20 R50=R50_U_Bank_U_Channel_U_Switch#20 R?=R?_U_Bank_U_Channel_U_Switch#60 R?=R?_U_Bank_U_Channel_U_Switch#59 R?=R?_U_Bank_U_Channel_U_Switch#58 T7=T7_U_Bank_U_Channel_U_Switch#20 T8=T8_U_Bank_U_Channel_U_Switch#20 U1=U1_U_Bank_U_Channel_U_Switch#20; ports CURR_MEAS_ENA=NetIC2_U_Bank_U_Channel#10_7 FAULT_VSET=NetR37_U_Bank_U_Channel_U_Switch#1_1 HV_CURR=NetIC8_23 OFF=NetIC2_U_Bank_U_Channel#10_3 RESET=NetIC2_U_Bank_U_Channel#10_5 STATUS=NetIC2_U_Bank_U_Channel#10_11 VCC=NetC41_U_Bank_U_Channel_U_Switch#1_1 VIN=NetC?#3_2 WARN=W_B1 WARN_VSET=NetR?_U_Bank_U_Channel_U_Switch#3_1
U_Bank/U_Channel/U_Switch: designators C38=C38_U_Bank_U_Channel_U_Switch#21 C39=C39_U_Bank_U_Channel_U_Switch#21 C40=C40_U_Bank_U_Channel_U_Switch#21 C41=C41_U_Bank_U_Channel_U_Switch#21 C42=C42_U_Bank_U_Channel_U_Switch#21 C43=C43_U_Bank_U_Channel_U_Switch#21 C44=C44_U_Bank_U_Channel_U_Switch#21 D51=D51_U_Bank_U_Channel_U_Switch#21 IC13=IC13_U_Bank_U_Channel_U_Switch#21 IC14=IC14_U_Bank_U_Channel_U_Switch#21 IC15=IC15_U_Bank_U_Channel_U_Switch#21 IC16=IC16_U_Bank_U_Channel_U_Switch#21 J4=J4_U_Bank_U_Channel_U_Switch#21 LD3=LD3_U_Bank_U_Channel_U_Switch#21 LD4=LD4_U_Bank_U_Channel_U_Switch#21 LD5=LD5_U_Bank_U_Channel_U_Switch#21 PB3=PB3_U_Bank_U_Channel_U_Switch#21 PB4=PB4_U_Bank_U_Channel_U_Switch#21 R31=R31_U_Bank_U_Channel_U_Switch#21 R32=R32_U_Bank_U_Channel_U_Switch#21 R33=R33_U_Bank_U_Channel_U_Switch#21 R34=R34_U_Bank_U_Channel_U_Switch#21 R37=R37_U_Bank_U_Channel_U_Switch#21 R41=R41_U_Bank_U_Channel_U_Switch#21 R42=R42_U_Bank_U_Channel_U_Switch#21 R43=R43_U_Bank_U_Channel_U_Switch#21 R44=R44_U_Bank_U_Channel_U_Switch#21 R45=R45_U_Bank_U_Channel_U_Switch#21 R46=R46_U_Bank_U_Channel_U_Switch#21 R47=R47_U_Bank_U_Channel_U_Switch#21 R48=R48_U_Bank_U_Channel_U_Switch#21 R49=R49_U_Bank_U_Channel_U_Switch#21 R50=R50_U_Bank_U_Channel_U_Switch#21 R?=R?_U_Bank_U_Channel_U_Switch#63 R?=R?_U_Bank_U_Channel_U_Switch#62 R?=R?_U_Bank_U_Channel_U_Switch#61 T7=T7_U_Bank_U_Channel_U_Switch#21 T8=T8_U_Bank_U_Channel_U_Switch#21 U1=U1_U_Bank_U_Channel_U_Switch#21; ports CURR_MEAS_ENA=NetIC2_U_Bank_U_Channel#11_14 FAULT_VSET=NetR37_U_Bank_U_Channel_U_Switch#1_1 HV_CURR=NetIC8_23 OFF=NetIC2_U_Bank_U_Channel#11_18 RESET=NetIC2_U_Bank_U_Channel#11_16 STATUS=NetIC2_U_Bank_U_Channel#11_8 VCC=NetC41_U_Bank_U_Channel_U_Switch#1_1 VIN=NetC?#3_2 WARN=W_A2 WARN_VSET=NetR?_U_Bank_U_Channel_U_Switch#3_1
U_Bank/U_Channel/U_Switch: designators C38=C38_U_Bank_U_Channel_U_Switch#22 C39=C39_U_Bank_U_Channel_U_Switch#22 C40=C40_U_Bank_U_Channel_U_Switch#22 C41=C41_U_Bank_U_Channel_U_Switch#22 C42=C42_U_Bank_U_Channel_U_Switch#22 C43=C43_U_Bank_U_Channel_U_Switch#22 C44=C44_U_Bank_U_Channel_U_Switch#22 D51=D51_U_Bank_U_Channel_U_Switch#22 IC13=IC13_U_Bank_U_Channel_U_Switch#22 IC14=IC14_U_Bank_U_Channel_U_Switch#22 IC15=IC15_U_Bank_U_Channel_U_Switch#22 IC16=IC16_U_Bank_U_Channel_U_Switch#22 J4=J4_U_Bank_U_Channel_U_Switch#22 LD3=LD3_U_Bank_U_Channel_U_Switch#22 LD4=LD4_U_Bank_U_Channel_U_Switch#22 LD5=LD5_U_Bank_U_Channel_U_Switch#22 PB3=PB3_U_Bank_U_Channel_U_Switch#22 PB4=PB4_U_Bank_U_Channel_U_Switch#22 R31=R31_U_Bank_U_Channel_U_Switch#22 R32=R32_U_Bank_U_Channel_U_Switch#22 R33=R33_U_Bank_U_Channel_U_Switch#22 R34=R34_U_Bank_U_Channel_U_Switch#22 R37=R37_U_Bank_U_Channel_U_Switch#22 R41=R41_U_Bank_U_Channel_U_Switch#22 R42=R42_U_Bank_U_Channel_U_Switch#22 R43=R43_U_Bank_U_Channel_U_Switch#22 R44=R44_U_Bank_U_Channel_U_Switch#22 R45=R45_U_Bank_U_Channel_U_Switch#22 R46=R46_U_Bank_U_Channel_U_Switch#22 R47=R47_U_Bank_U_Channel_U_Switch#22 R48=R48_U_Bank_U_Channel_U_Switch#22 R49=R49_U_Bank_U_Channel_U_Switch#22 R50=R50_U_Bank_U_Channel_U_Switch#22 R?=R?_U_Bank_U_Channel_U_Switch#66 R?=R?_U_Bank_U_Channel_U_Switch#65 R?=R?_U_Bank_U_Channel_U_Switch#64 T7=T7_U_Bank_U_Channel_U_Switch#22 T8=T8_U_Bank_U_Channel_U_Switch#22 U1=U1_U_Bank_U_Channel_U_Switch#22; ports CURR_MEAS_ENA=NetIC2_U_Bank_U_Channel#11_7 FAULT_VSET=NetR37_U_Bank_U_Channel_U_Switch#1_1 HV_CURR=NetIC8_23 OFF=NetIC2_U_Bank_U_Channel#11_3 RESET=NetIC2_U_Bank_U_Channel#11_5 STATUS=NetIC2_U_Bank_U_Channel#11_11 VCC=NetC41_U_Bank_U_Channel_U_Switch#1_1 VIN=NetC?#3_2 WARN=W_B2 WARN_VSET=NetR?_U_Bank_U_Channel_U_Switch#3_1
U_Bank/U_Channel/U_Switch: designators C38=C38_U_Bank_U_Channel_U_Switch#23 C39=C39_U_Bank_U_Channel_U_Switch#23 C40=C40_U_Bank_U_Channel_U_Switch#23 C41=C41_U_Bank_U_Channel_U_Switch#23 C42=C42_U_Bank_U_Channel_U_Switch#23 C43=C43_U_Bank_U_Channel_U_Switch#23 C44=C44_U_Bank_U_Channel_U_Switch#23 D51=D51_U_Bank_U_Channel_U_Switch#23 IC13=IC13_U_Bank_U_Channel_U_Switch#23 IC14=IC14_U_Bank_U_Channel_U_Switch#23 IC15=IC15_U_Bank_U_Channel_U_Switch#23 IC16=IC16_U_Bank_U_Channel_U_Switch#23 J4=J4_U_Bank_U_Channel_U_Switch#23 LD3=LD3_U_Bank_U_Channel_U_Switch#23 LD4=LD4_U_Bank_U_Channel_U_Switch#23 LD5=LD5_U_Bank_U_Channel_U_Switch#23 PB3=PB3_U_Bank_U_Channel_U_Switch#23 PB4=PB4_U_Bank_U_Channel_U_Switch#23 R31=R31_U_Bank_U_Channel_U_Switch#23 R32=R32_U_Bank_U_Channel_U_Switch#23 R33=R33_U_Bank_U_Channel_U_Switch#23 R34=R34_U_Bank_U_Channel_U_Switch#23 R37=R37_U_Bank_U_Channel_U_Switch#23 R41=R41_U_Bank_U_Channel_U_Switch#23 R42=R42_U_Bank_U_Channel_U_Switch#23 R43=R43_U_Bank_U_Channel_U_Switch#23 R44=R44_U_Bank_U_Channel_U_Switch#23 R45=R45_U_Bank_U_Channel_U_Switch#23 R46=R46_U_Bank_U_Channel_U_Switch#23 R47=R47_U_Bank_U_Channel_U_Switch#23 R48=R48_U_Bank_U_Channel_U_Switch#23 R49=R49_U_Bank_U_Channel_U_Switch#23 R50=R50_U_Bank_U_Channel_U_Switch#23 R?=R?_U_Bank_U_Channel_U_Switch#69 R?=R?_U_Bank_U_Channel_U_Switch#68 R?=R?_U_Bank_U_Channel_U_Switch#67 T7=T7_U_Bank_U_Channel_U_Switch#23 T8=T8_U_Bank_U_Channel_U_Switch#23 U1=U1_U_Bank_U_Channel_U_Switch#23; ports CURR_MEAS_ENA=NetIC2_U_Bank_U_Channel#12_14 FAULT_VSET=NetR37_U_Bank_U_Channel_U_Switch#1_1 HV_CURR=NetIC8_23 OFF=NetIC2_U_Bank_U_Channel#12_18 RESET=NetIC2_U_Bank_U_Channel#12_16 STATUS=NetIC2_U_Bank_U_Channel#12_8 VCC=NetC41_U_Bank_U_Channel_U_Switch#1_1 VIN=NetC?#3_2 WARN=W_A3 WARN_VSET=NetR?_U_Bank_U_Channel_U_Switch#3_1
U_Bank/U_Channel/U_Switch: designators C38=C38_U_Bank_U_Channel_U_Switch#24 C39=C39_U_Bank_U_Channel_U_Switch#24 C40=C40_U_Bank_U_Channel_U_Switch#24 C41=C41_U_Bank_U_Channel_U_Switch#24 C42=C42_U_Bank_U_Channel_U_Switch#24 C43=C43_U_Bank_U_Channel_U_Switch#24 C44=C44_U_Bank_U_Channel_U_Switch#24 D51=D51_U_Bank_U_Channel_U_Switch#24 IC13=IC13_U_Bank_U_Channel_U_Switch#24 IC14=IC14_U_Bank_U_Channel_U_Switch#24 IC15=IC15_U_Bank_U_Channel_U_Switch#24 IC16=IC16_U_Bank_U_Channel_U_Switch#24 J4=J4_U_Bank_U_Channel_U_Switch#24 LD3=LD3_U_Bank_U_Channel_U_Switch#24 LD4=LD4_U_Bank_U_Channel_U_Switch#24 LD5=LD5_U_Bank_U_Channel_U_Switch#24 PB3=PB3_U_Bank_U_Channel_U_Switch#24 PB4=PB4_U_Bank_U_Channel_U_Switch#24 R31=R31_U_Bank_U_Channel_U_Switch#24 R32=R32_U_Bank_U_Channel_U_Switch#24 R33=R33_U_Bank_U_Channel_U_Switch#24 R34=R34_U_Bank_U_Channel_U_Switch#24 R37=R37_U_Bank_U_Channel_U_Switch#24 R41=R41_U_Bank_U_Channel_U_Switch#24 R42=R42_U_Bank_U_Channel_U_Switch#24 R43=R43_U_Bank_U_Channel_U_Switch#24 R44=R44_U_Bank_U_Channel_U_Switch#24 R45=R45_U_Bank_U_Channel_U_Switch#24 R46=R46_U_Bank_U_Channel_U_Switch#24 R47=R47_U_Bank_U_Channel_U_Switch#24 R48=R48_U_Bank_U_Channel_U_Switch#24 R49=R49_U_Bank_U_Channel_U_Switch#24 R50=R50_U_Bank_U_Channel_U_Switch#24 R?=R?_U_Bank_U_Channel_U_Switch#72 R?=R?_U_Bank_U_Channel_U_Switch#71 R?=R?_U_Bank_U_Channel_U_Switch#70 T7=T7_U_Bank_U_Channel_U_Switch#24 T8=T8_U_Bank_U_Channel_U_Switch#24 U1=U1_U_Bank_U_Channel_U_Switch#24; ports CURR_MEAS_ENA=NetIC2_U_Bank_U_Channel#12_7 FAULT_VSET=NetR37_U_Bank_U_Channel_U_Switch#1_1 HV_CURR=NetIC8_23 OFF=NetIC2_U_Bank_U_Channel#12_3 RESET=NetIC2_U_Bank_U_Channel#12_5 STATUS=NetIC2_U_Bank_U_Channel#12_11 VCC=NetC41_U_Bank_U_Channel_U_Switch#1_1 VIN=NetC?#3_2 WARN=W_B3 WARN_VSET=NetR?_U_Bank_U_Channel_U_Switch#3_1
U_Bank/U_Channel/U_Switch: designators C38=C38_U_Bank_U_Channel_U_Switch#25 C39=C39_U_Bank_U_Channel_U_Switch#25 C40=C40_U_Bank_U_Channel_U_Switch#25 C41=C41_U_Bank_U_Channel_U_Switch#25 C42=C42_U_Bank_U_Channel_U_Switch#25 C43=C43_U_Bank_U_Channel_U_Switch#25 C44=C44_U_Bank_U_Channel_U_Switch#25 D51=D51_U_Bank_U_Channel_U_Switch#25 IC13=IC13_U_Bank_U_Channel_U_Switch#25 IC14=IC14_U_Bank_U_Channel_U_Switch#25 IC15=IC15_U_Bank_U_Channel_U_Switch#25 IC16=IC16_U_Bank_U_Channel_U_Switch#25 J4=J4_U_Bank_U_Channel_U_Switch#25 LD3=LD3_U_Bank_U_Channel_U_Switch#25 LD4=LD4_U_Bank_U_Channel_U_Switch#25 LD5=LD5_U_Bank_U_Channel_U_Switch#25 PB3=PB3_U_Bank_U_Channel_U_Switch#25 PB4=PB4_U_Bank_U_Channel_U_Switch#25 R31=R31_U_Bank_U_Channel_U_Switch#25 R32=R32_U_Bank_U_Channel_U_Switch#25 R33=R33_U_Bank_U_Channel_U_Switch#25 R34=R34_U_Bank_U_Channel_U_Switch#25 R37=R37_U_Bank_U_Channel_U_Switch#25 R41=R41_U_Bank_U_Channel_U_Switch#25 R42=R42_U_Bank_U_Channel_U_Switch#25 R43=R43_U_Bank_U_Channel_U_Switch#25 R44=R44_U_Bank_U_Channel_U_Switch#25 R45=R45_U_Bank_U_Channel_U_Switch#25 R46=R46_U_Bank_U_Channel_U_Switch#25 R47=R47_U_Bank_U_Channel_U_Switch#25 R48=R48_U_Bank_U_Channel_U_Switch#25 R49=R49_U_Bank_U_Channel_U_Switch#25 R50=R50_U_Bank_U_Channel_U_Switch#25 R?=R?_U_Bank_U_Channel_U_Switch#75 R?=R?_U_Bank_U_Channel_U_Switch#74 R?=R?_U_Bank_U_Channel_U_Switch#73 T7=T7_U_Bank_U_Channel_U_Switch#25 T8=T8_U_Bank_U_Channel_U_Switch#25 U1=U1_U_Bank_U_Channel_U_Switch#25; ports CURR_MEAS_ENA=NetIC2_U_Bank_U_Channel#13_14 FAULT_VSET=NetR37_U_Bank_U_Channel_U_Switch#1_1 HV_CURR=NetIC8_23 OFF=NetIC2_U_Bank_U_Channel#13_18 RESET=NetIC2_U_Bank_U_Channel#13_16 STATUS=NetIC2_U_Bank_U_Channel#13_8 VCC=NetC41_U_Bank_U_Channel_U_Switch#1_1 VIN=NetC?#3_2 WARN=W_A0 WARN_VSET=NetR?_U_Bank_U_Channel_U_Switch#3_1
U_Bank/U_Channel/U_Switch: designators C38=C38_U_Bank_U_Channel_U_Switch#26 C39=C39_U_Bank_U_Channel_U_Switch#26 C40=C40_U_Bank_U_Channel_U_Switch#26 C41=C41_U_Bank_U_Channel_U_Switch#26 C42=C42_U_Bank_U_Channel_U_Switch#26 C43=C43_U_Bank_U_Channel_U_Switch#26 C44=C44_U_Bank_U_Channel_U_Switch#26 D51=D51_U_Bank_U_Channel_U_Switch#26 IC13=IC13_U_Bank_U_Channel_U_Switch#26 IC14=IC14_U_Bank_U_Channel_U_Switch#26 IC15=IC15_U_Bank_U_Channel_U_Switch#26 IC16=IC16_U_Bank_U_Channel_U_Switch#26 J4=J4_U_Bank_U_Channel_U_Switch#26 LD3=LD3_U_Bank_U_Channel_U_Switch#26 LD4=LD4_U_Bank_U_Channel_U_Switch#26 LD5=LD5_U_Bank_U_Channel_U_Switch#26 PB3=PB3_U_Bank_U_Channel_U_Switch#26 PB4=PB4_U_Bank_U_Channel_U_Switch#26 R31=R31_U_Bank_U_Channel_U_Switch#26 R32=R32_U_Bank_U_Channel_U_Switch#26 R33=R33_U_Bank_U_Channel_U_Switch#26 R34=R34_U_Bank_U_Channel_U_Switch#26 R37=R37_U_Bank_U_Channel_U_Switch#26 R41=R41_U_Bank_U_Channel_U_Switch#26 R42=R42_U_Bank_U_Channel_U_Switch#26 R43=R43_U_Bank_U_Channel_U_Switch#26 R44=R44_U_Bank_U_Channel_U_Switch#26 R45=R45_U_Bank_U_Channel_U_Switch#26 R46=R46_U_Bank_U_Channel_U_Switch#26 R47=R47_U_Bank_U_Channel_U_Switch#26 R48=R48_U_Bank_U_Channel_U_Switch#26 R49=R49_U_Bank_U_Channel_U_Switch#26 R50=R50_U_Bank_U_Channel_U_Switch#26 R?=R?_U_Bank_U_Channel_U_Switch#78 R?=R?_U_Bank_U_Channel_U_Switch#77 R?=R?_U_Bank_U_Channel_U_Switch#76 T7=T7_U_Bank_U_Channel_U_Switch#26 T8=T8_U_Bank_U_Channel_U_Switch#26 U1=U1_U_Bank_U_Channel_U_Switch#26; ports CURR_MEAS_ENA=NetIC2_U_Bank_U_Channel#13_7 FAULT_VSET=NetR37_U_Bank_U_Channel_U_Switch#1_1 HV_CURR=NetIC8_23 OFF=NetIC2_U_Bank_U_Channel#13_3 RESET=NetIC2_U_Bank_U_Channel#13_5 STATUS=NetIC2_U_Bank_U_Channel#13_11 VCC=NetC41_U_Bank_U_Channel_U_Switch#1_1 VIN=NetC?#3_2 WARN=W_B0 WARN_VSET=NetR?_U_Bank_U_Channel_U_Switch#3_1
U_Bank/U_Channel/U_Switch: designators C38=C38_U_Bank_U_Channel_U_Switch#27 C39=C39_U_Bank_U_Channel_U_Switch#27 C40=C40_U_Bank_U_Channel_U_Switch#27 C41=C41_U_Bank_U_Channel_U_Switch#27 C42=C42_U_Bank_U_Channel_U_Switch#27 C43=C43_U_Bank_U_Channel_U_Switch#27 C44=C44_U_Bank_U_Channel_U_Switch#27 D51=D51_U_Bank_U_Channel_U_Switch#27 IC13=IC13_U_Bank_U_Channel_U_Switch#27 IC14=IC14_U_Bank_U_Channel_U_Switch#27 IC15=IC15_U_Bank_U_Channel_U_Switch#27 IC16=IC16_U_Bank_U_Channel_U_Switch#27 J4=J4_U_Bank_U_Channel_U_Switch#27 LD3=LD3_U_Bank_U_Channel_U_Switch#27 LD4=LD4_U_Bank_U_Channel_U_Switch#27 LD5=LD5_U_Bank_U_Channel_U_Switch#27 PB3=PB3_U_Bank_U_Channel_U_Switch#27 PB4=PB4_U_Bank_U_Channel_U_Switch#27 R31=R31_U_Bank_U_Channel_U_Switch#27 R32=R32_U_Bank_U_Channel_U_Switch#27 R33=R33_U_Bank_U_Channel_U_Switch#27 R34=R34_U_Bank_U_Channel_U_Switch#27 R37=R37_U_Bank_U_Channel_U_Switch#27 R41=R41_U_Bank_U_Channel_U_Switch#27 R42=R42_U_Bank_U_Channel_U_Switch#27 R43=R43_U_Bank_U_Channel_U_Switch#27 R44=R44_U_Bank_U_Channel_U_Switch#27 R45=R45_U_Bank_U_Channel_U_Switch#27 R46=R46_U_Bank_U_Channel_U_Switch#27 R47=R47_U_Bank_U_Channel_U_Switch#27 R48=R48_U_Bank_U_Channel_U_Switch#27 R49=R49_U_Bank_U_Channel_U_Switch#27 R50=R50_U_Bank_U_Channel_U_Switch#27 R?=R?_U_Bank_U_Channel_U_Switch#81 R?=R?_U_Bank_U_Channel_U_Switch#80 R?=R?_U_Bank_U_Channel_U_Switch#79 T7=T7_U_Bank_U_Channel_U_Switch#27 T8=T8_U_Bank_U_Channel_U_Switch#27 U1=U1_U_Bank_U_Channel_U_Switch#27; ports CURR_MEAS_ENA=NetIC2_U_Bank_U_Channel#14_14 FAULT_VSET=NetR37_U_Bank_U_Channel_U_Switch#1_1 HV_CURR=NetIC8_23 OFF=NetIC2_U_Bank_U_Channel#14_18 RESET=NetIC2_U_Bank_U_Channel#14_16 STATUS=NetIC2_U_Bank_U_Channel#14_8 VCC=NetC41_U_Bank_U_Channel_U_Switch#1_1 VIN=NetC?#3_2 WARN=W_A1 WARN_VSET=NetR?_U_Bank_U_Channel_U_Switch#3_1